# Altium project TemperatureController.PrjPcb (part 2 of 4)

## Sheet relays.SchDoc: TemperatureTransducer
size A3; Author: wq; DrawnBy: wq; Organization: Fulei Electronic; Address1: 14a Yulan Rd; Address2: Hefei; Address3: Anhui Pro.; Address4: CHN; DocumentNumber: 1; Revision: betaV1.0; SheetNumber: 1; SheetTotal: 1
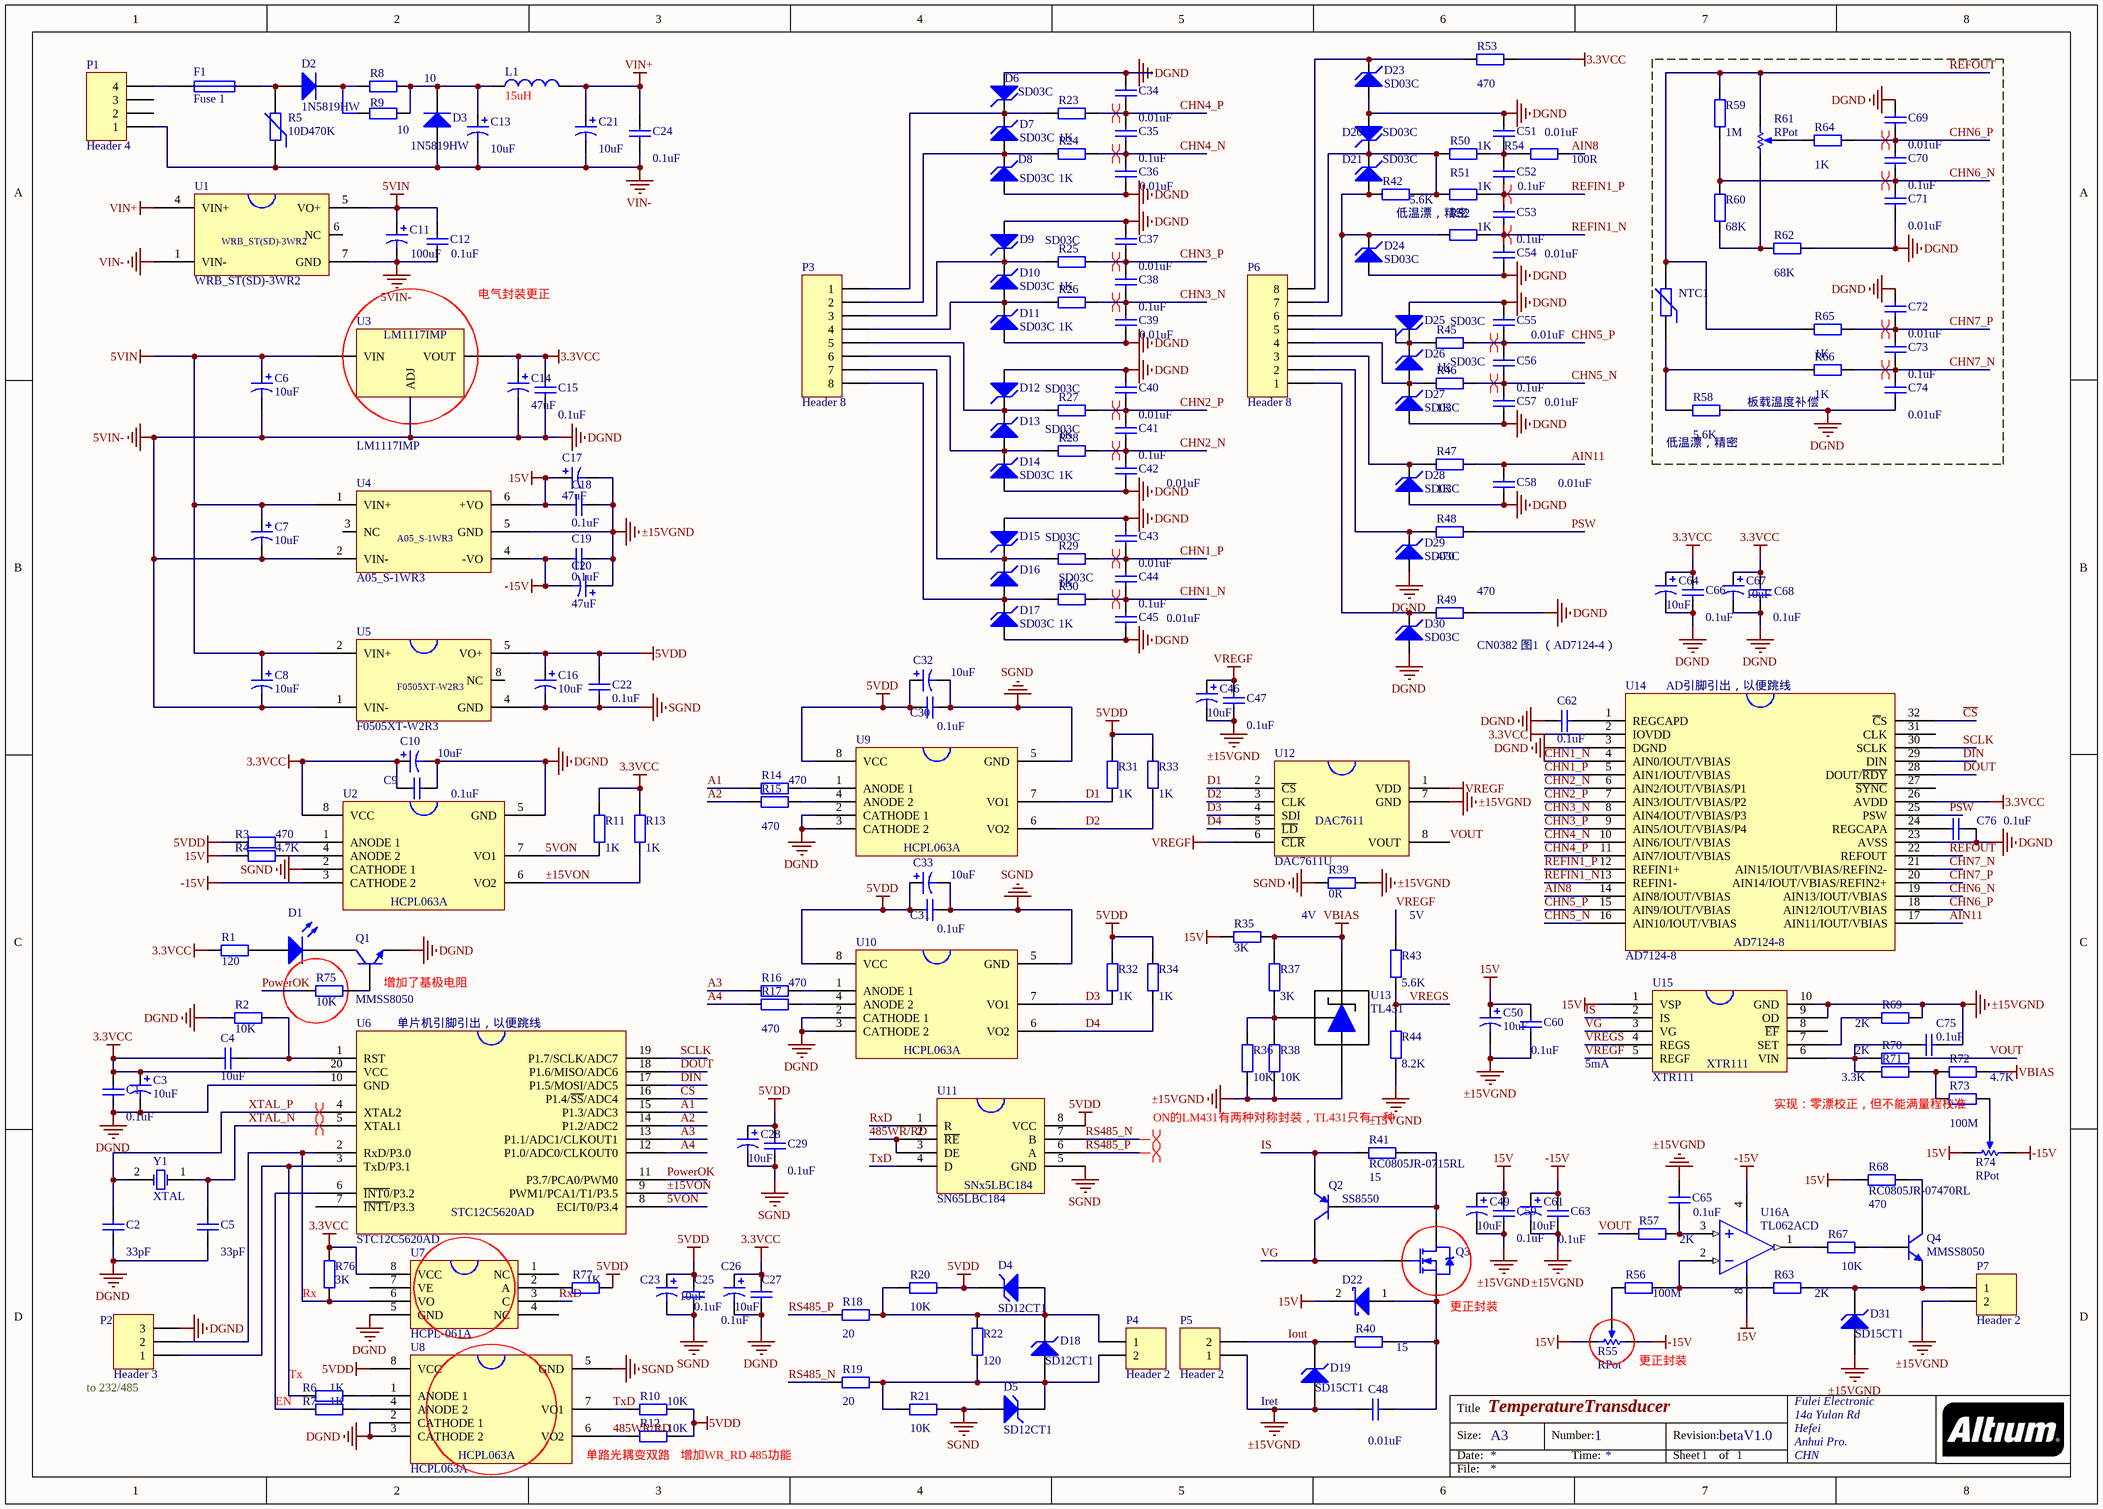
[diagram p2: relays.SchDoc]

### Parts
(Parts that share a designator on the sheet are numbered #1, #2 ... from top to bottom, then left to right.)
C1#2  value 0.1uF  [0805c]  (hidden comment: CC0805MRX7R9BB104)
C2#2  value 33pF  [0805c]  (hidden comment: CC0805MRX7R9BB330)
C3#2  value 10uF  [CB]  (hidden comment: T494B106M006AHAUTO)
C4#2  value 10uF  [0805c]  (hidden comment: CC0805MRX7R9BB106)
C5#2  value 33pF  [0805c]  (hidden comment: CC0805MRX7R9BB330)
C6#2  value 10uF  [CB]  (hidden comment: T494B106M006AHAUTO)
C7#2  value 10uF  [CB]  (hidden comment: T494B106M006AHAUTO)
C8#2  value 10uF  [CB]  (hidden comment: T494B106M006AHAUTO)
C9#2  value 0.1uF  [0805c]  (hidden comment: CC0805MRX7R9BB104)
C10#2  value 10uF  [CB]  (hidden comment: T494B106M006AHAUTO)
C11#2  value 100uF  [CB]  (hidden comment: T494B107M006AHAUTO)
C12#2  value 0.1uF  [0805c]  (hidden comment: CC0805MRX7R9BB104)
C13#2  value 10uF  [Φ6.3×11.5]  (hidden comment: ECR1HQG100M-063007)
C14#2  value 47uF  [CB]  (hidden comment: T494B476M010AHAUTO)
C15#2  value 0.1uF  [0805c]  (hidden comment: CC0805MRX7R9BB104)
C16#2  value 10uF  [CB]  (hidden comment: T494B106M006AHAUTO)
C17#2  value 47uF  [CB]  (hidden comment: T494B476K025ATAUTO)
C18#2  value 0.1uF  [0805c]  (hidden comment: CC0805MRX7R9BB104)
C19#2  value 0.1uF  [0805c]  (hidden comment: CC0805MRX7R9BB104)
C20#2  value 47uF  [CB]  (hidden comment: T494B476K025ATAUTO)
C21#2  value 10uF  [Φ6.3×11.5]  (hidden comment: ECR1HQG100M-063007)
C22#2  value 0.1uF  [0805c]  (hidden comment: CC0805MRX7R9BB104)
C23#2  value 10uF  [CB]  (hidden comment: T494B106M006AHAUTO)
C24#2  value 0.1uF  [0805c]  (hidden comment: CC0805MRX7R9BB104)
C25#2  value 0.1uF  [0805c]  (hidden comment: CC0805MRX7R9BB104)
C26#2  value 10uF  [CB]  (hidden comment: T494B106M006AHAUTO)
C27#2  value 0.1uF  [0805c]  (hidden comment: CC0805MRX7R9BB104)
C28#2  value 10uF  [CB]  (hidden comment: T494B106M006AHAUTO)
C29#2  value 0.1uF  [0805c]  (hidden comment: CC0805MRX7R9BB104)
C30#3  value 0.1uF  [0805c]  (hidden comment: CC0805MRX7R9BB104)
C31#2  value 0.1uF  [0805c]  (hidden comment: CC0805MRX7R9BB104)
C32#3  value 10uF  [CB]  (hidden comment: T494B106M006AHAUTO)
C33#2  value 10uF  [CB]  (hidden comment: T494B106M006AHAUTO)
C34#2  value 0.01uF  [0805c]  (hidden comment: CC0805MRX7R9BB103)
C35#2  value 0.1uF  [0805c]  (hidden comment: CC0805MRX7R9BB104)
C36#2  value 0.01uF  [0805c]  (hidden comment: CC0805MRX7R9BB103)
C37#2  value 0.01uF  [0805c]  (hidden comment: CC0805MRX7R9BB103)
C38#2  value 0.1uF  [0805c]  (hidden comment: CC0805MRX7R9BB104)
C39#2  value 0.01uF  [0805c]  (hidden comment: CC0805MRX7R9BB103)
C40#2  value 0.01uF  [0805c]  (hidden comment: CC0805MRX7R9BB103)
C41#2  value 0.1uF  [0805c]  (hidden comment: CC0805MRX7R9BB104)
C42#2  value 0.01uF  [0805c]  (hidden comment: CC0805MRX7R9BB103)
C43#2  value 0.01uF  [0805c]  (hidden comment: CC0805MRX7R9BB103)
C44#2  value 0.1uF  [0805c]  (hidden comment: CC0805MRX7R9BB104)
C45#2  value 0.01uF  [0805c]  (hidden comment: CC0805MRX7R9BB103)
C46#3  value 10uF  [CB]  (hidden comment: T494B106M006AHAUTO)
C47#3  value 0.1uF  [0805c]  (hidden comment: CC0805MRX7R9BB104)
C48#2  value 0.01uF  [0805c]  (hidden comment: CC0805MRX7R9BB103)
C49#2  value 10uF  [CB]  (hidden comment: T494B106M025AHAUTO)
C50#2  value 10uF  [CB]  (hidden comment: T494B106M025AHAUTO)
C51#2  value 0.01uF  [0805c]  (hidden comment: CC0805MRX7R9BB103)
C52#2  value 0.1uF  [0805c]  (hidden comment: CC0805MRX7R9BB104)
C53#2  value 0.1uF  [0805c]  (hidden comment: CC0805MRX7R9BB104)
C54#2  value 0.01uF  [0805c]  (hidden comment: CC0805MRX7R9BB103)
C55#2  value 0.01uF  [0805c]  (hidden comment: CC0805MRX7R9BB103)
C56#2  value 0.1uF  [0805c]  (hidden comment: CC0805MRX7R9BB104)
C57#2  value 0.01uF  [0805c]  (hidden comment: CC0805MRX7R9BB103)
C58#2  value 0.01uF  [0805c]  (hidden comment: CC0805MRX7R9BB103)
C59#2  value 0.1uF  [0805c]  (hidden comment: CC0805MRX7R9BB104)
C60#2  value 0.1uF  [0805c]  (hidden comment: CC0805MRX7R9BB104)
C61#2  value 10uF  [CB]  (hidden comment: T494B106M025AHAUTO)
C62#2  value 0.1uF  [0805c]  (hidden comment: CC0805MRX7R9BB104)
C63#2  value 0.1uF  [0805c]  (hidden comment: CC0805MRX7R9BB104)
C64#2  value 10uF  [CB]  (hidden comment: T494B106M006AHAUTO)
C65#2  value 0.1uF  [0805c]  (hidden comment: CC0805MRX7R9BB104)
C66#2  value 0.1uF  [0805c]  (hidden comment: CC0805MRX7R9BB104)
C67#2  value 10uF  [CB]  (hidden comment: T494B106M006AHAUTO)
C68#2  value 0.1uF  [0805c]  (hidden comment: CC0805MRX7R9BB104)
C69#2  value 0.01uF  [0805c]  (hidden comment: CC0805MRX7R9BB103)
C70#2  value 0.1uF  [0805c]  (hidden comment: CC0805MRX7R9BB104)
C71#2  value 0.01uF  [0805c]  (hidden comment: CC0805MRX7R9BB103)
C72#2  value 0.01uF  [0805c]  (hidden comment: CC0805MRX7R9BB103)
C73#2  value 0.1uF  [0805c]  (hidden comment: CC0805MRX7R9BB104)
C74#2  value 0.01uF  [0805c]  (hidden comment: CC0805MRX7R9BB103)
C75#2  value 0.1uF  [0805c]  (hidden comment: CC0805MRX7R9BB104)
C76#2  value 0.1uF  [0805c]  (hidden comment: CC0805MRX7R9BB104)
D1#2  150080GS75000  [LEDΦ3.0]  (value not drawn)
D2#2  1N5819HW  [sod123]
D3#2  1N5819HW  [sod123]
D4#2  SD12CT1  [sod323]
D5#2  SD12CT1  [sod323]
D6#2  SD03C  [sod323]
D7#2  SD03C  [sod323]
D8#2  SD03C  [sod323]
D9#2  SD03C  [sod323]
D10#2  SD03C  [sod323]
D11#2  SD03C  [sod323]
D12#2  SD03C  [sod323]
D13#2  SD03C  [sod323]
D14#2  SD03C  [sod323]
D15#2  SD03C  [sod323]
D16#2  SD03C  [sod323]
D17#2  SD03C  [sod323]
D18#2  SD12CT1  [sod323]
D19#2  SD15CT1  [sod323]
D20#2  SD03C  [sod323]
D21#2  SD03C  [sod323]
D22#2  RB160MM-50TF  [sod123]  (value not drawn)
D23#2  SD03C  [sod323]
D24#2  SD03C  [sod323]
D25#2  SD03C  [sod323]
D26#2  SD03C  [sod323]
D27#2  SD03C  [sod323]
D28#2  SD03C  [sod323]
D29#2  SD03C  [sod323]
D30#2  SD03C  [sod323]
D31#2  SD15CT1  [sod323]
F1#2  Fuse 1  [0805r]
L1#2  value 15uH  [vls4012]  (hidden comment: VLS4012HBX-150M)
NTC1#2  NTCS0805E3103JHT  [0805r]  (value not drawn)
P1#2  Header 4  [HDR1X4]
P2#2  Header 3  [HDR1X3]
P3#2  Header 8  [HDR1X8]
P4#2  Header 2  [HDR1X2]
P5#2  Header 2  [HDR1X2]
P6#2  Header 8  [HDR1X8]
P7#2  Header 2  [HDR1X2]
Q1#2  MMSS8050  [SOT-23-BJT]
Q2#2  SS8550  [SOT-23-BJT]
Q3#2  SI2309  [SOT-23-MOS]  (value not drawn)
Q4#2  MMSS8050  [SOT-23-BJT]
R1#2  value 120  [0805R]  (hidden comment: RC0805JR-07120RL)
R2#2  value 10K  [0805R]  (hidden comment: RC0805JR-0710KL)
R3#2  value 470  [0805R]  (hidden comment: RC0805JR-07470RL)
R4#2  value 4.7K  [0805R]  (hidden comment: RC0805JR-074700RL)
R5#2  10D470K  [mov]
R6#2  value 1K  [0805R]  (hidden comment: RC0805JR-071KL)
R7#2  value 1K  [0805R]  (hidden comment: RC0805JR-071KL)
R8#2  value 10  [0805R]  (hidden comment: PNP-200KJBJ26-10R)
R9#2  value 10  [0805R]  (hidden comment: PNP-200KJBJ26-10R)
R10#2  value 10K  [0805R]  (hidden comment: RC0805JR-0710KRL)
R11#2  value 1K  [0805R]  (hidden comment: RC0805JR-071KL)
R12#2  value 10K  [0805R]  (hidden comment: RC0805JR-0710KRL)
R13#2  value 1K  [0805R]  (hidden comment: RC0805JR-071KL)
R14#2  value 470  [0805R]  (hidden comment: RC0805JR-07470RL)
R15#2  value 470  [0805R]  (hidden comment: RC0805JR-07470RL)
R16#2  value 470  [0805R]  (hidden comment: RC0805JR-07470RL)
R17#2  value 470  [0805R]  (hidden comment: RC0805JR-07470RL)
R18#2  value 20  [0805R]  (hidden comment: RC0805JR-0720RL)
R19#2  value 20  [0805R]  (hidden comment: RC0805JR-0720RL)
R20#2  value 10K  [0805R]  (hidden comment: RC0805JR-0710KL)
R21#2  value 10K  [0805R]  (hidden comment: RC0805JR-0710KL)
R22#2  value 120  [0805R]  (hidden comment: RC0805JR-07120RL)
R23#2  value 1K  [0805R]  (hidden comment: RC0805JR-071KL)
R24#2  value 1K  [0805R]  (hidden comment: RC0805JR-071KL)
R25#2  value 1K  [0805R]  (hidden comment: RC0805JR-071KL)
R26#2  value 1K  [0805R]  (hidden comment: RC0805JR-071KL)
R27#2  value 1K  [0805R]  (hidden comment: RC0805JR-071KL)
R28#2  value 1K  [0805R]  (hidden comment: RC0805JR-071KL)
R29#2  value 1K  [0805R]  (hidden comment: RC0805JR-071KL)
R30#2  value 1K  [0805R]  (hidden comment: RC0805JR-071KL)
R31#2  value 1K  [0805R]  (hidden comment: RC0805JR-071KL)
R32#2  value 1K  [0805R]  (hidden comment: RC0805JR-071KL)
R33#2  value 1K  [0805R]  (hidden comment: RC0805JR-071KL)
R34#2  value 1K  [0805R]  (hidden comment: RC0805JR-071KL)
R35#2  value 3K  [0805R]  (hidden comment: RC0805JR-073KL)
R36#2  value 10K  [0805R]  (hidden comment: RC0805JR-0710KL)
R37#2  value 3K  [0805R]  (hidden comment: RC0805JR-073KL)
R38#2  value 10K  [0805R]  (hidden comment: RC0805JR-0710KL)
R39#2  value 0R  [0805R]  (hidden comment: RC0805JR-000KL)
R40#2  value 15  [0805R]  (hidden comment: RC0805JR-0715RL)
R41#2  RC0805JR-0715RL  value 15  [0805R]
R42#2  value 5.6K  [0805R]  (hidden comment: RC0805JR-075600RL)
R43#2  value 5.6K  [0805R]  (hidden comment: RC0805JR-075600RL)
R44#2  value 8.2K  [0805R]  (hidden comment: RC0805JR-078200RL)
R45#2  value 1K  [0805R]  (hidden comment: RC0805JR-071KL)
R46#2  value 1K  [0805R]  (hidden comment: RC0805JR-071KL)
R47#2  value 1K  [0805R]  (hidden comment: RC0805JR-071KL)
R48#2  value 470  [0805R]  (hidden comment: RC0805JR-07470RL)
R49#2  value 470  [0805R]  (hidden comment: RC0805JR-07470RL)
R50#2  value 1K  [0805R]  (hidden comment: RC0805JR-071KL)
R51#2  value 1K  [0805R]  (hidden comment: RC0805JR-071KL)
R52#2  value 1K  [0805R]  (hidden comment: RC0805JR-071KL)
R53#2  value 470  [0805R]  (hidden comment: RC0805JR-07470RL)
R54#2  value 100R  [0805R]  (hidden comment: RC0805JR-07100RL)
R55#2  RPot  [VR5]
R56#2  value 100M  [0805R]  (hidden comment: RC0805JR-07100ML)
R57#2  value 2K  [0805R]  (hidden comment: RC0805JR-072KL)
R58#2  value 5.6K  [0805R]  (hidden comment: RC0805JR-075600RL)
R59#2  value 1M  [0805R]  (hidden comment: RC0805JR-071000KL)
R60#2  value 68K  [0805R]  (hidden comment: RC0805JR-0768KL)
R61#2  RPot  [VR5]
R62#2  value 68K  [0805R]  (hidden comment: RC0805JR-0768KL)
R63#2  value 2K  [0805R]  (hidden comment: RC0805JR-072KL)
R64#2  value 1K  [0805R]  (hidden comment: RC0805JR-071KL)
R65#2  value 1K  [0805R]  (hidden comment: RC0805JR-071KL)
R66#2  value 1K  [0805R]  (hidden comment: RC0805JR-071KL)
R67#2  value 10K  [0805R]  (hidden comment: RC0805JR-0710KL)
R68#2  RC0805JR-07470RL  value 470  [0805R]
R69#2  value 2K  [0805R]  (hidden comment: RC0805JR-072KL)
R70#2  value 2K  [0805R]  (hidden comment: RC0805JR-072KL)
R71#2  value 3.3K  [0805R]  (hidden comment: RC0805JR-073300RL)
R72#2  value 4.7K  [0805R]  (hidden comment: RC0805JR-074700RL)
R73#2  value 100M  [0805R]  (hidden comment: RC0805JR-07100ML)
R74#2  RPot  [VR5]
R75#2  value 10K  [0805R]  (hidden comment: RC0805JR-0710KL)
R76#2  value 3K  [0805R]  (hidden comment: RC0805JR-073KL)
R77#2  value 1K  [0805R]  (hidden comment: RC0805JR-071KL)
U1#2  WRB_ST(SD)-3WR2  [WRB_ST(SD)-3WR2]
U2#2  HCPL063A  [SO-8-N]  (value not drawn)
U3#2  LM1117IMP  [SOT223_M]
U4#2  A05_S-1WR3  [A05_S-1WR3]
U5#2  F0505XT-W2R3  [F0505XT-W2R3]
U6#2  STC12C5620AD  [SOP20]
U7#2  HCPL-061A  [SO-8-N]
U8#2  HCPL063A  [SO-8-N]
U9#2  HCPL063A  [SO-8-N]  (value not drawn)
U10#2  HCPL063A  [SO-8-N]  (value not drawn)
U11#2  SN65LBC184  [so-8-n]
U12#3  DAC7611U  [so-8-n]
U13#2  TL431  [SOT-23-3]
U14#2  AD7124-8  [TI-RHB32-3150X3150TP_V]
U15#2  XTR111  [S-PDSO-G10]
U16#2  TL062ACD  [so-8-n]  (part A of 2)
Y1#2  XTAL  [11.0592MHz]

### Nets
3.3VCC: C1#2.1 C3#2.1 C4#2.1 C9#2.1 C10#2.1 C14#2.1 C15#2.1 C26#2.1 C27#2.1 C64#2.1 C66#2.1 C67#2.1 C68#2.1 R1#2.1 R11#2.1 R13#2.1 R53#2.1 R76#2.2 U2#2.8(VCC) U3#2.2(VOUT) U6#2.20(VCC) U7#2.8(VCC) U14#2.2(IOVDD) U14#2.26(AVDD)
5VDD: C16#2.1 C22#2.2 C23#2.1 C25#2.1 C28#2.1 C29#2.1 C30#3.1 C31#2.1 C32#3.1 C33#2.1 D4#2.2(K) R3#2.2 R10#2.1 R12#2.1 R20#2.1 R31#2.1 R32#2.1 R33#2.1 R34#2.1 R77#2.1 U5#2.5(VO+) U8#2.8(VCC) U9#2.8(VCC) U10#2.8(VCC) U11#2.8(VCC)
5VIN: C6#2.1 C7#2.1 C8#2.1 C11#2.1 C12#2.2 U1#2.5(VO+) U3#2.3(VIN) U4#2.1(VIN+) U5#2.2(VIN+)
5VIN-: C1#2.2 C2#2.2 C3#2.2 C5#2.2 C6#2.2 C7#2.2 C8#2.2 C9#2.2 C10#2.2 C11#2.2 C12#2.1 C14#2.2 C15#2.2 C26#2.2 C27#2.2 C34#2.2 C36#2.2 C37#2.2 C39#2.2 C40#2.2 C42#2.2 C43#2.2 C45#2.2 C51#2.2 C54#2.2 C55#2.2 C57#2.2 C58#2.2 C62#2.1 C64#2.2 C66#2.2 C67#2.2 C68#2.2 C69#2.2 C71#2.2 C72#2.2 C74#2.2 C76#2.1 D6#2.1(ANODE) D8#2.1(ANODE) D9#2.1(ANODE) D11#2.1(ANODE) D12#2.1(ANODE) D14#2.1(ANODE) D15#2.1(ANODE) D17#2.1(ANODE) D20#2.1(ANODE) D23#2.1(ANODE) D24#2.1(ANODE) D25#2.1(ANODE) D27#2.1(ANODE) D28#2.1(ANODE) D29#2.1(ANODE) D30#2.1(ANODE) P2#2.3 Q1#2.3(E) R2#2.1 R49#2.1 R58#2.1 R62#2.1 U1#2.7(GND) U2#2.5(GND) U3#2.1(ADJ) U4#2.2(VIN-) U5#2.1(VIN-) U6#2.10(GND) U7#2.5(GND) U8#2.2(CATHODE_1) U8#2.3(CATHODE_2) U9#2.2(CATHODE_1) U9#2.3(CATHODE_2) U10#2.2(CATHODE_1) U10#2.3(CATHODE_2) U14#2.3(DGND) U14#2.23(AVSS)  [also labelled DGND]
15V: C17#2.1 C18#2.1 C49#2.1 C50#2.1 C59#2.2 C60#2.2 D22#2.2(K) R4#2.2 R35#2.1 R55#2.1(BOT) R68#2.1 R74#2.1(BOT) U4#2.6(+VO) U15#2.1(VSP) U16#2.8(VCC+)
-15V: C19#2.1 C20#2.2 C61#2.1 C63#2.2 R55#2.3(TOP) R74#2.3(TOP) U2#2.3(CATHODE_2) U4#2.4(-VO) U16#2.4(VCC-)
SGND: C16#2.2 C22#2.1 C23#2.2 C25#2.2 C28#2.2 C29#2.2 C30#3.2 C31#2.2 C32#3.2 C33#2.2 D5#2.1(A) R21#2.1 R39#2.1 U2#2.2(CATHODE_1) U5#2.4(GND) U8#2.5(GND) U9#2.5(GND) U10#2.5(GND) U11#2.5(GND)
VBIAS: R35#2.2 R37#2.1 R72#2.1 U13#2.1(CATHODE)
VIN+: C21#2.1 C24#2.1 L1#2.2 U1#2.4(VIN+)
VIN-: C13#2.2 C21#2.2 C24#2.2 D3#2.1(A) P1#2.1 R5#2.1 U1#2.1(VIN-)
VREGF: C46#3.1 C47#3.2 R43#2.1 U12#3.1(VDD) U12#3.6(~{CLR}) U15#2.5(REGF)
±15VGND: C17#2.2 C18#2.2 C19#2.2 C20#2.1 C46#3.2 C47#3.1 C48#2.2 C49#2.2 C50#2.2 C59#2.1 C60#2.1 C61#2.2 C63#2.1 C65#2.2 C75#2.1 D19#2.1(A) D31#2.1(A) P5#2.1 P7#2.2 R36#2.2 R38#2.2 R39#2.2 R44#2.2 R69#2.1 U4#2.5(GND) U12#3.7(GND) U13#2.3(ANODE) U15#2.9(OD) U15#2.10(GND)
5VON: R11#2.2 U2#2.7(VO1) U6#2.8(ECI/T0/P3.4)
485WR/RD: R12#2.2 U8#2.6(VO2) U11#2.2(~{RE}) U11#2.3(DE)
A1: R14#2.2 U6#2.15(P1.3/ADC3)
A2: R15#2.2 U6#2.14(P1.2/ADC2)
A3: R16#2.2 U6#2.13(P1.1/ADC1/CLKOUT1)
A4: R17#2.2 U6#2.12(P1.0/ADC0/CLKOUT0)
AIN8: R54#2.1 U14#2.14(AIN8/IOUT/VBIAS)
AIN11: C58#2.1 R47#2.1 U14#2.17(AIN11/IOUT/VBIAS)
~{CS}: U6#2.16(P1.4/~{SS}/ADC4) U14#2.32(~{C}S)
CHN1_N: C44#2.2 C45#2.1 R30#2.1 U14#2.4(AIN0/IOUT/VBIAS)
CHN1_P: C43#2.1 C44#2.1 R29#2.1 U14#2.5(AIN1/IOUT/VBIAS)
CHN2_N: C41#2.2 C42#2.1 R28#2.1 U14#2.6(AIN2/IOUT/VBIAS/P1)
CHN2_P: C40#2.1 C41#2.1 R27#2.1 U14#2.7(AIN3/IOUT/VBIAS/P2)
CHN3_N: C38#2.2 C39#2.1 R26#2.1 U14#2.8(AIN4/IOUT/VBIAS/P3)
CHN3_P: C37#2.1 C38#2.1 R25#2.1 U14#2.9(AIN5/IOUT/VBIAS/P4)
CHN4_N: C35#2.2 C36#2.1 R24#2.1 U14#2.10(AIN6/IOUT/VBIAS)
CHN4_P: C34#2.1 C35#2.1 R23#2.1 U14#2.11(AIN7/IOUT/VBIAS)
CHN5_N: C56#2.2 C57#2.1 R46#2.1 U14#2.16(AIN10/IOUT/VBIAS)
CHN5_P: C55#2.1 C56#2.1 R45#2.1 U14#2.15(AIN9/IOUT/VBIAS)
CHN6_N: C70#2.2 C71#2.1 R59#2.2 R60#2.1 U14#2.19(AIN13/IOUT/VBIAS)
CHN6_P: C69#2.1 C70#2.1 R64#2.1 U14#2.18(AIN12/IOUT/VBIAS)
CHN7_N: C73#2.2 C74#2.1 R66#2.1 U14#2.21(AIN15/IOUT/VBIAS/REFIN2-)
CHN7_P: C72#2.1 C73#2.1 R65#2.1 U14#2.20(AIN14/IOUT/VBIAS/REFIN2+)
D1: R31#2.2 U9#2.7(VO1) U12#3.2(~{CS})
D2: R33#2.2 U9#2.6(VO2) U12#3.3(CLK)
D3: R32#2.2 U10#2.7(VO1) U12#3.4(SDI)
D4: R34#2.2 U10#2.6(VO2) U12#3.5(~{LD})
DIN: U6#2.17(P1.5/MOSI/ADC5) U14#2.29(DIN)
DOUT: U6#2.18(P1.6/MISO/ADC6) U14#2.28(DOUT/~{RDY})
Iout: D19#2.2(K) P5#2.2 R40#2.1
IS: Q2#2.3(E) R41#2.2 U15#2.2(IS)
PowerOK: R75#2.1 U6#2.11(P3.7/PCA0/PWM0)
PSW: R48#2.1 U14#2.25(PSW)
REFIN1_N: C53#2.2 C54#2.1 R52#2.1 U14#2.13(REFIN1-)
REFIN1_P: C52#2.1 C53#2.1 R51#2.1 U14#2.12(REFIN1+)
REFOUT: NTC1#2.2 R59#2.1 R61#2.1(BOT) R65#2.2 U14#2.22(REFOUT)
RS485_N: R19#2.2 U11#2.7(B)
RS485_P: R18#2.1 U11#2.6(A)
RxD: U7#2.3(C) U11#2.1(R)
SCLK: U6#2.19(P1.7/SCLK/ADC7) U14#2.30(SCLK)
TxD: R10#2.2 U8#2.7(VO1) U11#2.4(D)
VG: Q2#2.1(C) Q3#2.1(G) U15#2.3(VG)
VOUT: R57#2.2 R70#2.1 U12#3.8(VOUT)
VREGS: R43#2.2 R44#2.1 U15#2.4(REGS)
XTAL_N: C5#2.1 U6#2.5(XTAL1) Y1#2.1(OSC1)
XTAL_P: C2#2.1 U6#2.4(XTAL2) Y1#2.2(OSC2)
±15VON: R13#2.2 U2#2.6(VO2) U6#2.9(PWM1/PCA1/T1/P3.5)
NetC4#2_2: C4#2.2 R2#2.2 U6#2.1(RST)
NetC13#2_1: C13#2.1 D3#2.2(K) L1#2.1 R8#2.1 R9#2.1
NetC48#2_1: C48#2.1 D22#2.1(A) Q3#2.3(S) R40#2.2
NetC51#2_1: C51#2.1 C52#2.2 R50#2.1 R54#2.2
NetC62#2_2: C62#2.2 U14#2.1(REGCAPD)
NetC65#2_1: C65#2.1 R57#2.1 U16#2.3(IN1+)
NetC75#2_2: C75#2.2 R70#2.2 R71#2.2 U15#2.6(VIN)
NetC76#2_2: C76#2.2 U14#2.24(REGCAPA)
NetD1#2_1: D1#2.1(A) R1#2.2
NetD1#2_2: D1#2.2(K) Q1#2.1(C)
NetD2#2_1: D2#2.1(A) F1#2.2 R5#2.2
NetD2#2_2: D2#2.2(K) R8#2.2 R9#2.2
NetD4#2_1: D4#2.1(A) D18#2.2(K) P4#2.1 R18#2.2 R20#2.2 R22#2.2
NetD5#2_2: D5#2.2(K) D18#2.1(A) P4#2.2 R19#2.1 R21#2.2 R22#2.1
NetD6#2_2: D6#2.2(CATHODE) D7#2.2(CATHODE) P3#2.1 R23#2.2
NetD7#2_1: D7#2.1(ANODE) D8#2.2(CATHODE) P3#2.2 R24#2.2
NetD9#2_2: D9#2.2(CATHODE) D10#2.2(CATHODE) P3#2.3 R25#2.2
NetD10#2_1: D10#2.1(ANODE) D11#2.2(CATHODE) P3#2.4 R26#2.2
NetD12#2_2: D12#2.2(CATHODE) D13#2.2(CATHODE) P3#2.5 R27#2.2
NetD13#2_1: D13#2.1(ANODE) D14#2.2(CATHODE) P3#2.6 R28#2.2
NetD15#2_2: D15#2.2(CATHODE) D16#2.2(CATHODE) P3#2.7 R29#2.2
NetD16#2_1: D16#2.1(ANODE) D17#2.2(CATHODE) P3#2.8 R30#2.2
NetD20#2_2: D20#2.2(CATHODE) D21#2.2(CATHODE) P6#2.7 R42#2.2 R50#2.2 R51#2.2
NetD21#2_1: D21#2.1(ANODE) D24#2.2(CATHODE) P6#2.6 R42#2.1 R52#2.2
NetD23#2_2: D23#2.2(CATHODE) P6#2.8 R53#2.2
NetD25#2_2: D25#2.2(CATHODE) D26#2.2(CATHODE) P6#2.5 R45#2.2
NetD26#2_1: D26#2.1(ANODE) D27#2.2(CATHODE) P6#2.4 R46#2.2
NetD28#2_2: D28#2.2(CATHODE) P6#2.3 R47#2.2
NetD29#2_2: D29#2.2(CATHODE) P6#2.2 R48#2.2
NetD30#2_2: D30#2.2(CATHODE) P6#2.1 R49#2.2
NetD31#2_2: D31#2.2(K) P7#2.1 Q4#2.3(E) R63#2.1
NetF1#2_1: F1#2.1 P1#2.4
NetNTC1#2_1: NTC1#2.1 R58#2.2 R66#2.2
NetP2#2_1: P2#2.1 R6#2.2 U6#2.3(TxD/P3.1)
NetP2#2_2: P2#2.2 R76#2.1 U6#2.2(RxD/P3.0) U7#2.6(VO)
NetQ1#2_2: Q1#2.2(B) R75#2.2
NetQ2#2_2: Q2#2.2(B) Q3#2.2(D) R41#2.1
NetQ4#2_1: Q4#2.1(C) R68#2.2
NetQ4#2_2: Q4#2.2(B) R67#2.1
NetR3#2_1: R3#2.1 U2#2.1(ANODE_1)
NetR4#2_1: R4#2.1 U2#2.4(ANODE_2)
NetR6#2_1: R6#2.1 U8#2.1(ANODE_1)
NetR7#2_1: R7#2.1 U8#2.4(ANODE_2)
NetR7#2_2: R7#2.2 U6#2.6(~{INT0}/P3.2)
NetR14#2_1: R14#2.1 U9#2.1(ANODE_1)
NetR15#2_1: R15#2.1 U9#2.4(ANODE_2)
NetR16#2_1: R16#2.1 U10#2.1(ANODE_1)
NetR17#2_1: R17#2.1 U10#2.4(ANODE_2)
NetR36#2_1: R36#2.1 R37#2.2 R38#2.1 U13#2.2(REF)
NetR55#2_2: R55#2.2(TAP) R56#2.2
NetR56#2_1: R56#2.1 R63#2.2 U16#2.2(IN1-)
NetR60#2_2: R60#2.2 R61#2.3(TOP) R62#2.2
NetR61#2_2: R61#2.2(TAP) R64#2.2
NetR67#2_2: R67#2.2 U16#2.1(OUT1)
NetR69#2_2: R69#2.2 U15#2.7(SET)
NetR71#2_1: R71#2.1 R72#2.2 R73#2.1
NetR73#2_2: R73#2.2 R74#2.2(TAP)
NetR77#2_2: R77#2.2 U7#2.2(A)

Not connected (* = marked no-connect by the designer): P1#2 2 3; U1#2 6(NC); U4#2 3(NC); U5#2 8(NC); U6#2 7(~{INT1}/P3.3); U7#2 1(NC) 4(NC) 7(VE); U14#2 27(~{SYNC}) 31(CLK); U15#2 8(~{EF})

### Layout directives
differential pair; differential pair class *: CHN1_P
differential pair: CHN1_N, CHN2_N, CHN2_P, CHN3_N, CHN3_P, CHN4_N, CHN4_P, CHN5_N, CHN5_P, CHN6_N, CHN6_P, CHN7_N, CHN7_P, REFIN1_N, REFIN1_P, RS485_N, RS485_P, XTAL_N, XTAL_P

### Notes on the sheet
- 低温漂，精密
- 电气封装更正
- (near R58#2) 低温漂，精密
- 板载温度补偿
- (near R49#2) CN0382 图1 （AD7124-4）
- (near U14#2) AD引脚引出，以便跳线
- 4V
- (near R43#2) 5V
- (near Q1#2) 增加了基极电阻
- (near U6#2) 单片机引脚引出，以便跳线
- ON的LM431有两种对称封装，TL431只有一种
- 5mA
- 实现：零漂校正，但不能满量程校准
- (near R76#2) Rx
- (near Q3#2) 更正封装
- (near P2#2) to 232/485
- Tx
- (near R55#2) 更正封装
- EN
- 单路光耦变双路
- (near R12#2) 增加WR_RD 485功能
- (near D19#2) Iret
- Title
- Size:
- Date:
- A3
- Number:
- Time:
- Revision:
- Sheet
- of
- File:

### Library data of the parts
C1#2 C2#2 C4#2 C5#2 C9#2 C12#2 C15#2 C18#2 C19#2 C22#2 C24#2 C25#2 C27#2 C29#2 C30#3 C31#2 C34#2 C35#2 C36#2 C37#2 C38#2 C39#2 C40#2 C41#2 C42#2 C43#2 C44#2 C45#2 C47#3 C48#2 C51#2 C52#2 C53#2 C54#2 C55#2 C56#2 C57#2 C58#2 C59#2 C60#2 C62#2 C63#2 C65#2 C66#2 C68#2 C69#2 C70#2 C71#2 C72#2 C73#2 C74#2 C75#2 C76#2 = Cap: Capacitor
  C2#2 C5#2 C9#2 C12#2 C15#2 C18#2 C19#2 C22#2 C24#2 C25#2 C27#2 C29#2 C30#3 C31#2 C34#2 C35#2 C36#2 C37#2 C38#2 C39#2 C40#2 C41#2 C42#2 C43#2 C44#2 C45#2 C47#3 C48#2 C51#2 C52#2 C53#2 C54#2 C55#2 C56#2 C57#2 C58#2 C59#2 C60#2 C62#2 C63#2 C65#2 C66#2 C68#2 C69#2 C70#2 C71#2 C72#2 C73#2 C74#2 C75#2 C76#2: Published: 8-Jun-2000; LatestRevisionDate: 17-Jul-2002; LatestRevisionNote: Re-released for DXP Platform.; PackageReference: RAD-0.3; Publisher: Altium Limited; PackageDescription: Radial Cap, Thru-Hole; 2 Leads; 0.3 in Pin Spacing
C3#2 C6#2 C7#2 C8#2 C10#2 C11#2 C13#2 C14#2 C16#2 C17#2 C20#2 C21#2 C23#2 C26#2 C28#2 C32#3 C33#2 C46#3 C49#2 C50#2 C61#2 C64#2 C67#2 = Cap Pol1: Polarized Capacitor (Radial); Published: 8-Jun-2000; LatestRevisionDate: 17-Jul-2002; LatestRevisionNote: Re-released for DXP Platform.; PackageReference: RB7.6-15; Publisher: Altium Limited; PackageDescription: Polarized Capacitor (Radial); 2 Leads
D1#2 = LED2: as D1#1 on sheet betaV1.0; Published: 8-Jun-2000; LatestRevisionDate: 17-Jul-2002; LatestRevisionNote: Re-released for DXP Platform.; PackageVersion: Feb-2002; PackageReference: 3.2X1.6X1.1; Publisher: Altium Limited; PackageDescription: SM LED; 2 Flat Leads
D2#2 D3#2 = Diode: Default Diode; Published: 8-Jun-2000; LatestRevisionDate: 17-Jul-2002; LatestRevisionNote: Re-released for DXP Platform.; PackageVersion: Sep-1996; PackageReference: SMC; Publisher: Altium Limited; PackageDescription: DO-214-AB/SMC; 2 C-Bend Leads; Body 7.9 x 5.9 mm, inc. leads (LxW); Code_JEDEC: DO-214-AB
D4#2 D5#2 D18#2 D19#2 D31#2 = D Zener: Zener Diode; Published: 8-Jun-2000; LatestRevisionDate: 17-Jul-2002; LatestRevisionNote: Re-released for DXP Platform.; PackageReference: DIODE-0.7; Publisher: Altium Limited; PackageDescription: Diode, Thru-Hole; 2 Leads; 0.7 in Pin Spacing
D6#2 D7#2 D8#2 D9#2 D10#2 D11#2 D12#2 D13#2 D14#2 D15#2 D16#2 D17#2 D20#2 D21#2 D23#2 D24#2 D25#2 D26#2 D27#2 D28#2 D29#2 D30#2 = TVS DIODE
D22#2 = D Schottky: Schottky Diode; Published: 8-Jun-2000; LatestRevisionDate: 17-Jul-2002; LatestRevisionNote: Re-released for DXP Platform.; PackageReference: SMB; Publisher: Altium Limited; PackageDescription: DO-214-AA/SMB; 2 C-Bend Leads; Body 5.3 x 3.6 mm, inc. leads (LxW); Code_JEDEC: DO-214-AA
F1#2 = Fuse 1: Fuse; Published: 8-Jun-2000; LatestRevisionDate: 17-Jul-2002; LatestRevisionNote: Re-released for DXP Platform.; PackageReference: PIN-W2/E2.8; Publisher: Altium Limited; PackageDescription: Thru-Hole; 2 Leads
L1#2 = Inductor
NTC1#2 R5#2 = Res Varistor: Varistor (Voltage-Sensitive Resistor); Published: 24-Mar-1999; LatestRevisionDate: 29-May-2009; LatestRevisionNote: IPC-7351 Footprint Added.; PackageVersion: Mar-2003; PackageReference: 6-0805; Publisher: Altium Limited; PackageDescription: Chip Resistor 0805 Case Size; Code_IPC: RESC2012
P1#2 = Header 4: Header, 4-Pin; LatestRevisionDate: 17-Jul-2002; LatestRevisionNote: Re-released for DXP Platform.; Publisher: Altium Limited
P2#2 = Header 3: Header, 3-Pin; LatestRevisionDate: 17-Jul-2002; LatestRevisionNote: Re-released for DXP Platform.; Publisher: Altium Limited
P3#2 P6#2 = Header 8: Header, 8-Pin; LatestRevisionDate: 17-Jul-2002; LatestRevisionNote: Re-released for DXP Platform.; Publisher: Altium Limited
P4#2 P5#2 P7#2 = Header 2: Header, 2-Pin; LatestRevisionDate: 17-Jul-2002; LatestRevisionNote: Re-released for DXP Platform.; Publisher: Altium Limited
Q1#2 Q4#2 = NPN: NPN Bipolar Transistor; Published: 8-Jun-2000; LatestRevisionDate: 17-Jul-2002; LatestRevisionNote: Re-released for DXP Platform.; PackageReference: TO-226-AA; Publisher: Altium Limited; PackageDescription: TO, Flat Index; 3 In-Line, Axial Leads; Body Dia. 4.8mm; Leads 0.55 x 0.51 mm (max); Code_JEDEC: TO-226-AA
Q2#2 = PNP: PNP Bipolar Transistor; Published: 8-Jun-2000; LatestRevisionDate: 29-May-2009; LatestRevisionNote: IPC-7351 Footprint Added.; PackageVersion: Aug-1999; PackageReference: SOT-23B; Publisher: Altium Limited; PackageDescription: 3-Pin SOT-23 Package 0.95 mm Pitch, 2.4 mm Lead Span
Q3#2 = NMOS-2: N-Channel Power MOSFET; Note: Pin 2 is electrically connected to pin 4.; Published: 8-Jun-2000; LatestRevisionDate: 17-Jul-2002; LatestRevisionNote: Re-released for DXP Platform.; DatasheetVersion: PD-9.814; PackageVersion: Feb-1997; PackageReference: TO-220AB; Publisher: Altium Limited; PackageDescription: TO, Thru-Hole, Vertical, Heatsink Mounted; 3 In-Line Leads; Pitch 2.54 mm; ComponentLink1Description: Manufacturer Link; ComponentLink1URL: http://www.irf.com/
R1#2 R2#2 R3#2 R4#2 R6#2 R7#2 R8#2 R9#2 R10#2 R11#2 R12#2 R13#2 R14#2 R15#2 R16#2 R17#2 R18#2 R19#2 R20#2 R21#2 R22#2 R23#2 R24#2 R25#2 R26#2 R27#2 R28#2 R29#2 R30#2 R31#2 R32#2 R33#2 R34#2 R35#2 R36#2 R37#2 R38#2 R39#2 R40#2 R41#2 R42#2 R43#2 R44#2 R45#2 R46#2 R47#2 R48#2 R49#2 R50#2 R51#2 R52#2 R53#2 R54#2 R56#2 R57#2 R58#2 R59#2 R60#2 R62#2 R63#2 R64#2 R65#2 R66#2 R67#2 R68#2 R69#2 R70#2 R71#2 R72#2 R73#2 R75#2 R76#2 R77#2 = Res2: Resistor; Published: 8-Jun-2000; LatestRevisionDate: 17-Jul-2002; LatestRevisionNote: Re-released for DXP Platform.; PackageReference: AXIAL-0.4; Publisher: Altium Limited; PackageDescription: Axial Device, Thru-Hole; 2 Leads; 0.4 in Pin Spacing
R55#2 R61#2 R74#2 = RPot: Potentiometer; Sim Note: Enter the Resistance value and the set point into parameter fields.; Set Position: 0.5; Value: 1K; Published: 8-Jun-2000; LatestRevisionDate: 17-Jul-2002; LatestRevisionNote: Re-released for DXP Platform.; PackageReference: VR5; Publisher: Altium Limited; PackageDescription: Variable Resistor, Thru-Hole; 3 Leads
U7#2 = 6N137
U11#2 = SNx5LBC184
U12#3 = DAC7611
U16#2 = TL062ACD: Low-Power JFET-Input Operational Amplifier, 7 to 36 V, 0 to 70 degC, 8-pin SOIC (D8), Green (RoHS & no Sb/Br); Manufacturer: Texas Instruments; CMRR(Min)(dB): 80; GBW(Typ)(MHz): 1; IIB(Max)(pA): 200; Iq per channel(Max)(mA): 0.25; Number of Channels: 2; Offset Drift(Typ)(uV/C): 10; Rating: Catalog; Slew Rate(Typ)(V/us): 3.5; Sub Family: General Purpose Amplifier, High Supply Voltage Amplifier (>=30V), Low Power Amp (<=500uA); Total Supply Voltage(Max)(+5V is 5, +/-5V is 10): 36; Total Supply Voltage(Min)(+5V is 5, +/-5V is 10): 7; Vio (25C)(Max)(mV): 6; Vn at 1kHz(Typ)(nV/rtHz): 42; DatasheetVersion: SLOS078J; PackageVersion: 4040047-3/M, 06/2011; PackageReference: D8; PackageDescription: 8-Pin Plastic Small Outline, Body 4.9 x 3.9 mm, Pitch 1.27 mm; Supplier 1: Digi-Key; Supplier Part Number 1: 296-7175-5-ND; Supplier 2: Farnell; Supplier Part Number 2: 9593241; Supplier 3: Newark; Supplier Part Number 3: 08F9224; Supplier 4: Mouser; Supplier Part Number 4: 595-TL062ACD; Eco-Plan: Green (RoHS & no Sb/Br); Mounting Technology: Surface Mount; Code_JEDEC: MS-012; PartNumber: TL062ACD; ComponentLink1Description: Manufacturer URL; ComponentLink1URL: http://www.ti.com/; ComponentLink2Description: Datasheet; ComponentLink2URL: http://www.ti.com/lit/ds/symlink/tl062a.pdf; ComponentLink3Description: Package Specification; ComponentLink3URL: http://www.ti.com/litv/pdf/msoi002j
Y1#2 = XTAL: Crystal Oscillator; Published: 8-Jun-2000; LatestRevisionDate: 17-Jul-2002; LatestRevisionNote: Re-released for DXP Platform.; PackageReference: R38; Publisher: Altium Limited; PackageDescription: Crystal, Thru-Hole; 2 Leads; Body 3.1 x 8.2 mm (Dia.xH)

## Sheet rs485.SchDoc
size A4; Organization: 合肥弗雷电子; Address1: 玉兰大道14号D栋3楼; Address2: 肥西县桃花镇; Address3: 合肥市; Address4: 安徽省
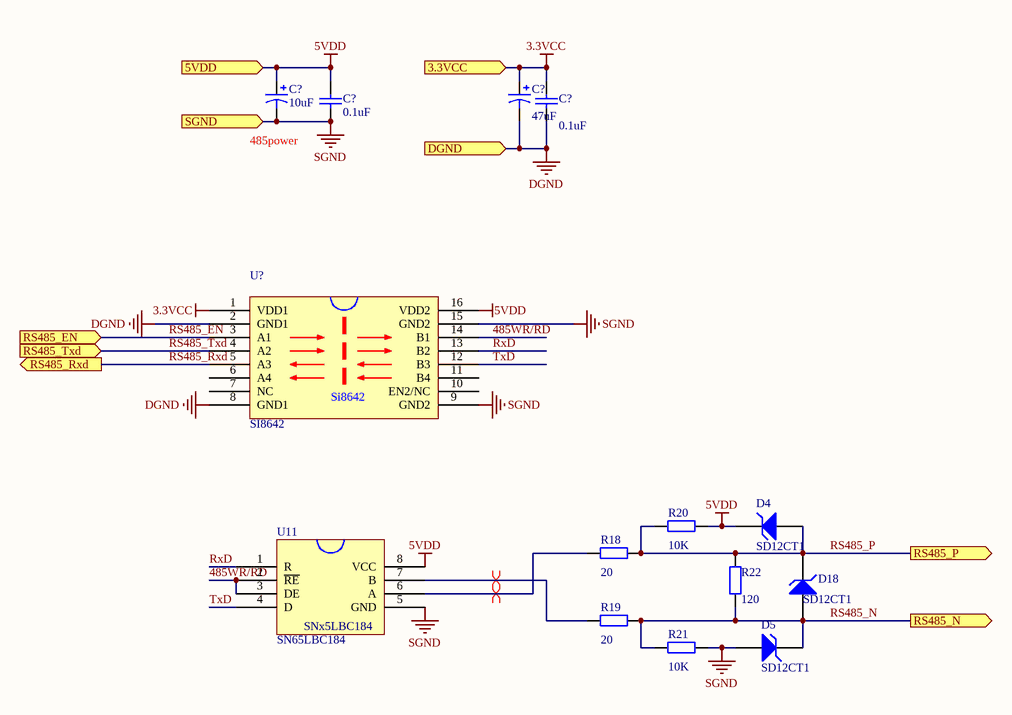
[diagram p3: rs485.SchDoc]

### Parts
(Parts that share a designator on the sheet are numbered #1, #2 ... from top to bottom, then left to right.)
C?#25  value 10uF  [CB]  (hidden comment: T494B106M006AHAUTO)
C?#26  value 47uF  [CB]  (hidden comment: T494B476M010AHAUTO)
C?#27  value 0.1uF  [0805c]  (hidden comment: CC0805MRX7R9BB104)
C?#28  value 0.1uF  [0805c]  (hidden comment: CC0805MRX7R9BB104)
D4#3  SD12CT1  [sod323]
D5#3  SD12CT1  [sod323]
D18#3  SD12CT1  [sod323]
R18#3  value 20  [0805R]  (hidden comment: RC0805JR-0720RL)
R19#3  value 20  [0805R]  (hidden comment: RC0805JR-0720RL)
R20#3  value 10K  [0805R]  (hidden comment: RC0805JR-0710KL)
R21#3  value 10K  [0805R]  (hidden comment: RC0805JR-0710KL)
R22#3  value 120  [0805R]  (hidden comment: RC0805JR-07120RL)
U11#3  SN65LBC184  [so-8-n]
U?#11  SI8642

### Ports
3.3VCC (in), 5VDD (in), DGND (in), RS485_EN (in), RS485_N (out), RS485_P (out), RS485_Rxd (out), RS485_Txd (in), SGND (in)

### Nets
3.3VCC: C?#26.1 C?#27.1 U?#11.1(VDD1) ; port 3.3VCC
5VDD: C?#25.1 C?#28.2 D4#3.2(K) R20#3.1 U11#3.8(VCC) U?#11.16(VDD2) ; port 5VDD
DGND: C?#26.2 C?#27.2 U?#11.2(GND1) U?#11.8(GND1) ; port DGND  [project net 5VIN-]
SGND: C?#25.2 C?#28.1 D5#3.1(A) R21#3.1 U11#3.5(GND) U?#11.9(GND2) U?#11.15(GND2) ; port SGND
485WR/RD: U11#3.2(~{RE}) U11#3.3(DE) U?#11.14(B1)
RS485_EN: U?#11.3(A1) ; port RS485_EN
RS485_N: D5#3.2(K) D18#3.1(A) R19#3.1 R21#3.2 R22#3.1 ; port RS485_N
RS485_P: D4#3.1(A) D18#3.2(K) R18#3.2 R20#3.2 R22#3.2 ; port RS485_P
RS485_Rxd: U?#11.5(A3) ; port RS485_Rxd
RS485_Txd: U?#11.4(A2) ; port RS485_Txd
RxD: U11#3.1(R) U?#11.13(B2)
TxD: U11#3.4(D) U?#11.12(B3)
NetR18#3_1: R18#3.1 U11#3.6(A)
NetR19#3_2: R19#3.2 U11#3.7(B)

Not connected (* = marked no-connect by the designer): U?#11 6(A4) 7(NC) 10(EN2/NC) 11(B4)

### Layout directives
differential pair: NetR18#3_1, NetR19#3_2

### Notes on the sheet
- (near C?#25) 485power
- Title
- Size:
- Date:
- A4
- Number:
- Time:
- Revision:
- Sheet
- of
- File:
- (in symbol SI8642) Si8642

### Library data of the parts
C?#25 C?#26 = Cap Pol1: Polarized Capacitor (Radial); Published: 8-Jun-2000; LatestRevisionDate: 17-Jul-2002; LatestRevisionNote: Re-released for DXP Platform.; PackageReference: RB7.6-15; Publisher: Altium Limited; PackageDescription: Polarized Capacitor (Radial); 2 Leads
C?#27 C?#28 = Cap: Capacitor; Published: 8-Jun-2000; LatestRevisionDate: 17-Jul-2002; LatestRevisionNote: Re-released for DXP Platform.; PackageReference: RAD-0.3; Publisher: Altium Limited; PackageDescription: Radial Cap, Thru-Hole; 2 Leads; 0.3 in Pin Spacing
D4#3 D5#3 D18#3 = D Zener: Zener Diode; Published: 8-Jun-2000; LatestRevisionDate: 17-Jul-2002; LatestRevisionNote: Re-released for DXP Platform.; PackageReference: DIODE-0.7; Publisher: Altium Limited; PackageDescription: Diode, Thru-Hole; 2 Leads; 0.7 in Pin Spacing
R18#3 R19#3 R20#3 R21#3 R22#3 = Res2: Resistor; Published: 8-Jun-2000; LatestRevisionDate: 17-Jul-2002; LatestRevisionNote: Re-released for DXP Platform.; PackageReference: AXIAL-0.4; Publisher: Altium Limited; PackageDescription: Axial Device, Thru-Hole; 2 Leads; 0.4 in Pin Spacing
U11#3 = SNx5LBC184

## Sheet hmi.SchDoc: HMI
size A4 portrait; Author: wq; DrawnBy: wq; Organization: Fulei Electronic; Address1: 14a Yulan Rd; Address2: Hefei; Address3: Anhui Pro.; Address4: CHN; DocumentNumber: 1; Revision: betaV1.0; SheetNumber: 1; SheetTotal: 1
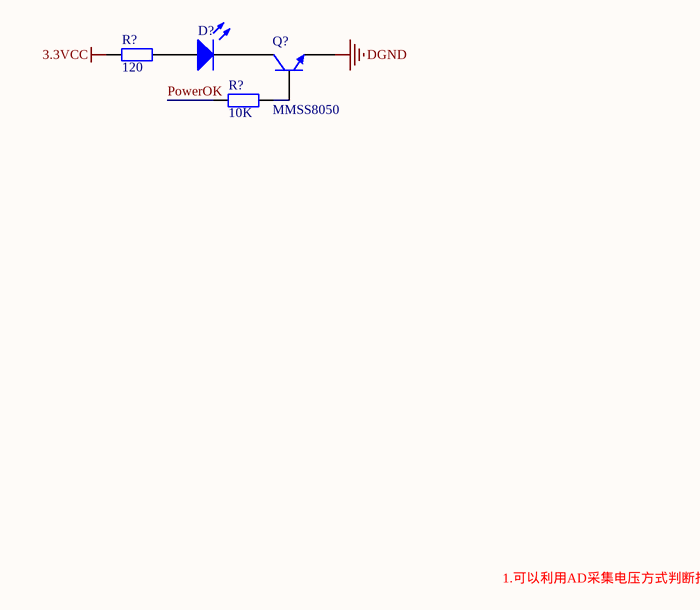
[diagram p4: hmi.SchDoc]

### Parts
(Parts that share a designator on the sheet are numbered #1, #2 ... from top to bottom, then left to right.)
D?#1  150080GS75000  [LEDΦ3.0]  (value not drawn)
Q?#1  MMSS8050  [SOT-23-BJT]
R?#1  value 120  [0805R]  (hidden comment: RC0805JR-07120RL)
R?#2  value 10K  [0805R]  (hidden comment: RC0805JR-0710KL)

### Nets
3.3VCC: R?#1.1
DGND: Q?#1.3(E)  [project net 5VIN-]
PowerOK: R?#2.1
NetD?#1_1: D?#1.1(A) R?#1.2
NetD?#1_2: D?#1.2(K) Q?#1.1(C)
NetQ?#1_2: Q?#1.2(B) R?#2.2

### Notes on the sheet
- 1.可以利用AD采集电压方式判断按钮；节约IO
- Title
- Size:
- Date:
- A4
- Number:
- Time:
- Revision:
- Sheet
- of
- File:

### Library data of the parts
D?#1 = LED2: Typical RED, GREEN, YELLOW, AMBER GaAs LED; Published: 8-Jun-2000; LatestRevisionDate: 17-Jul-2002; LatestRevisionNote: Re-released for DXP Platform.; PackageVersion: Feb-2002; PackageReference: 3.2X1.6X1.1; Publisher: Altium Limited; PackageDescription: SM LED; 2 Flat Leads
Q?#1 = NPN: NPN Bipolar Transistor; Published: 8-Jun-2000; LatestRevisionDate: 17-Jul-2002; LatestRevisionNote: Re-released for DXP Platform.; PackageReference: TO-226-AA; Publisher: Altium Limited; PackageDescription: TO, Flat Index; 3 In-Line, Axial Leads; Body Dia. 4.8mm; Leads 0.55 x 0.51 mm (max); Code_JEDEC: TO-226-AA
R?#1 R?#2 = Res2: Resistor; Published: 8-Jun-2000; LatestRevisionDate: 17-Jul-2002; LatestRevisionNote: Re-released for DXP Platform.; PackageReference: AXIAL-0.4; Publisher: Altium Limited; PackageDescription: Axial Device, Thru-Hole; 2 Leads; 0.4 in Pin Spacing

## Sheet iout.SchDoc: Iout
size A3; Organization: 合肥弗雷电子; Address1: 玉兰达到14号D栋3楼; Address2: 肥西县桃花镇; Address3: 合肥市; Address4: 安徽省; DocumentNumber: 1; Revision: betaV1.0; SheetNumber: 1; SheetTotal: 1

### Notes on the sheet
- Title
- Size:
- Date:
- A3
- Number:
- Time:
- Revision:
- Sheet
- of
- File:

## Sheet viout.SchDoc: VIout
size A3; Organization: 合肥弗雷电子; Address1: 玉兰达到14号D栋3楼; Address2: 肥西县桃花镇; Address3: 合肥市; Address4: 安徽省; Revision: betaV1.0; SheetNumber: 1; SheetTotal: 1
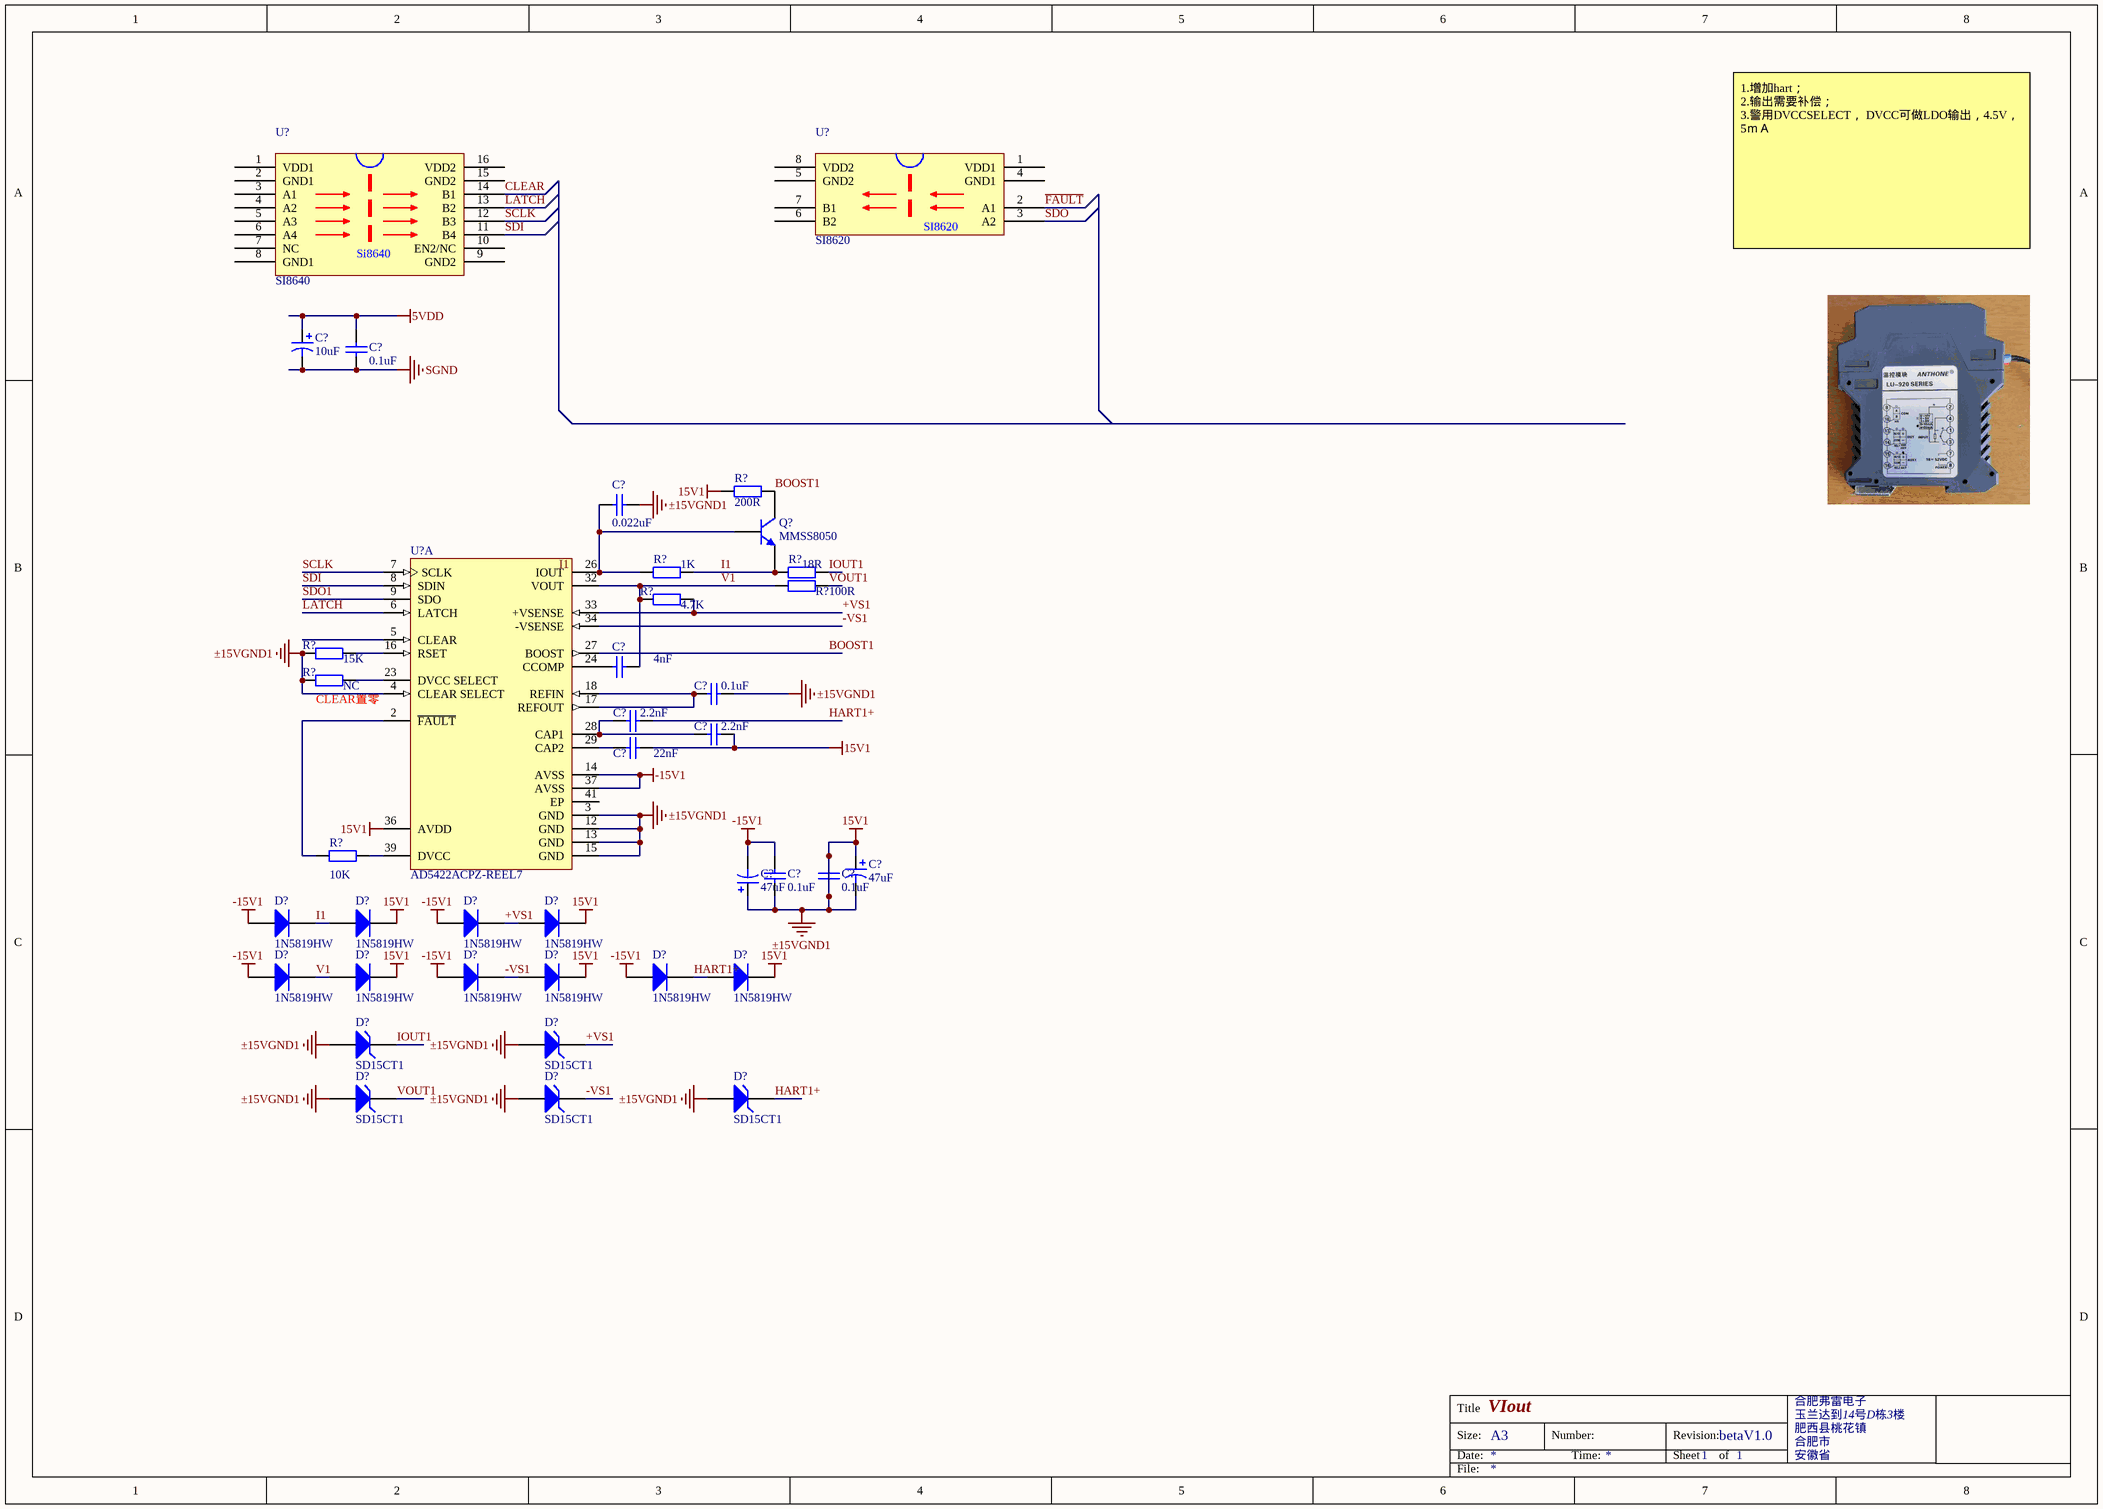
[diagram p5: viout.SchDoc]

### Parts
(Parts that share a designator on the sheet are numbered #1, #2 ... from top to bottom, then left to right.)
C?#29  value 10uF  [CB]  (hidden comment: T494B106M006AHAUTO)
C?#30  value 0.1uF  [0805c]  (hidden comment: CC0805MRX7R9BB104)
C?#31  value 0.022uF  [0805c]  (hidden comment: CC0805MRX7R9BB103)
C?#32  value 4nF  [0805c]
C?#33  value 0.1uF  [0805c]  (hidden comment: CC0805MRX7R9BB104)
C?#34  value 2.2nF  [0805c]
C?#35  value 2.2nF  [0805c]
C?#36  value 22nF  [0805c]
C?#37  value 0.1uF  [0805c]  (hidden comment: CC0805MRX7R9BB104)
C?#38  value 0.1uF  [0805c]  (hidden comment: CC0805MRX7R9BB104)
C?#39  value 47uF  [CB]  (hidden comment: T494B476K025ATAUTO)
C?#40  value 47uF  [CB]  (hidden comment: T494B476K025ATAUTO)
D?#2  1N5819HW  [sod123]
D?#3  1N5819HW  [sod123]
D?#4  1N5819HW  [sod123]
D?#5  1N5819HW  [sod123]
D?#6  1N5819HW  [sod123]
D?#7  1N5819HW  [sod123]
D?#8  1N5819HW  [sod123]
D?#9  1N5819HW  [sod123]
D?#10  1N5819HW  [sod123]
D?#11  1N5819HW  [sod123]
D?#12  SD15CT1  [sod323]
D?#13  SD15CT1  [sod323]
D?#14  SD15CT1  [sod323]
D?#15  SD15CT1  [sod323]
D?#16  SD15CT1  [sod323]
Q?#2  MMSS8050  [SOT-23-BJT]
R?#3  value 200R  [0805R]
R?#4  value 1K  [0805R]  (hidden comment: RC0805JR-071KL)
R?#5  value 18R  [0805R]
R?#6  value 100R  [0805R]
R?#7  value 4.7K  [0805R]
R?#8  value 15K  [0805R]  (hidden comment: E192)
R?#9  value NC  [0805R]  (hidden comment: E192)
R?#10  value 10K  [0805R]  (hidden comment: RC0805JR-0710KL)
U?#12  SI8640
U?#13  SI8620
U?#14  AD5422ACPZ-REEL7  [CP-40-1_N]  (part A of 2)

### Nets
5VDD: C?#29.1 C?#30.2
15V1: C?#31.1 C?#33.2 C?#35.1 C?#36.1 C?#37.2 C?#38.1 C?#38.2 C?#39.1 C?#39.2 C?#40.1 D?#3.2(K) D?#5.2(K) D?#7.2(K) D?#9.2(K) D?#11.2(K) D?#12.1(A) D?#13.1(A) D?#14.1(A) D?#15.1(A) D?#16.1(A) R?#3.2 R?#8.1 R?#9.1 U?#14.3(GND) U?#14.4(CLEAR_SELECT) U?#14.12(GND) U?#14.13(GND) U?#14.15(GND) U?#14.36(AVDD)  [also labelled ±15VGND1]
-15V1: C?#37.1 C?#40.2 D?#2.1(A) D?#4.1(A) D?#6.1(A) D?#8.1(A) D?#10.1(A) U?#14.14(AVSS) U?#14.37(AVSS)
SGND: C?#29.2 C?#30.1
+VS1: D?#4.2(K) D?#5.1(A) D?#13.2(K) R?#7.2 U?#14.33(+VSENSE)
-VS1: D?#8.2(K) D?#9.1(A) D?#15.2(K) U?#14.34(-VSENSE)
BOOST1: Q?#2.1(C) R?#3.1 U?#14.27(BOOST)
CLEAR: U?#12.14(B1)
~{FAULT}: U?#13.2(A1)
HART1+: C?#34.1 D?#10.2(K) D?#11.1(A) D?#16.2(K)
I1: D?#2.2(K) D?#3.1(A) Q?#2.3(E) R?#4.2 R?#5.1
IOUT1: D?#12.2(K) R?#5.2
LATCH: U?#12.13(B2) U?#14.6(LATCH)
SCLK: U?#12.12(B3) U?#14.7(SCLK)
SDI: U?#12.11(B4) U?#14.8(SDIN)
SDO: U?#13.3(A2)
SDO1: U?#14.9(SDO)
V1: C?#32.2 D?#6.2(K) D?#7.1(A) R?#6.1 R?#7.1 U?#14.32(VOUT)
VOUT1: D?#14.2(K) R?#6.2
NetC?#31_2: C?#31.2 Q?#2.2(B) R?#4.1 U?#14.26(IOUT)
NetC?#32_1: C?#32.1 U?#14.24(CCOMP)
NetC?#33_1: C?#33.1 U?#14.17(REFOUT) U?#14.18(REFIN)
NetC?#34_2: C?#34.2 C?#35.2 U?#14.28(CAP1)
NetC?#36_2: C?#36.2 U?#14.29(CAP2)
NetR?#8_2: R?#8.2 U?#14.16(RSET)
NetR?#9_2: R?#9.2 U?#14.23(DVCC_SELECT)
NetR?#10_1: R?#10.1 U?#14.39(DVCC)
NetR?#10_2: R?#10.2 U?#14.2(~{FAULT})

Not connected (* = marked no-connect by the designer): U?#12 1(VDD1) 2(GND1) 3(A1) 4(A2) 5(A3) 6(A4) 7(NC) 8(GND1) 9(GND2) 10(EN2/NC) 15(GND2) 16(VDD2); U?#13 1(VDD1) 4(GND1) 5(GND2) 6(B2) 7(B1) 8(VDD2); U?#14 5(CLEAR) 41(EP)

### Notes on the sheet
- 1.增加hart；
  2.输出需要补偿；
  3.警用DVCCSELECT， DVCC可做LDO输出，4.5V，5ｍＡ
- (near R?#9) CLEAR置零
- Labels drawn without touching a wire or pin: I1
- Title
- Size:
- Date:
- A3
- Number:
- Time:
- Revision:
- Sheet
- of
- File:
- (in symbol SI8640) Si8640

### Library data of the parts
C?#29 C?#39 C?#40 = Cap Pol1: Polarized Capacitor (Radial); Published: 8-Jun-2000; LatestRevisionDate: 17-Jul-2002; LatestRevisionNote: Re-released for DXP Platform.; PackageReference: RB7.6-15; Publisher: Altium Limited; PackageDescription: Polarized Capacitor (Radial); 2 Leads
C?#30-C?#38 = Cap: Capacitor; Published: 8-Jun-2000; LatestRevisionDate: 17-Jul-2002; LatestRevisionNote: Re-released for DXP Platform.; PackageReference: RAD-0.3; Publisher: Altium Limited; PackageDescription: Radial Cap, Thru-Hole; 2 Leads; 0.3 in Pin Spacing
D?#2-D?#11 = Diode: Default Diode; Published: 8-Jun-2000; LatestRevisionDate: 17-Jul-2002; LatestRevisionNote: Re-released for DXP Platform.; PackageVersion: Sep-1996; PackageReference: SMC; Publisher: Altium Limited; PackageDescription: DO-214-AB/SMC; 2 C-Bend Leads; Body 7.9 x 5.9 mm, inc. leads (LxW); Code_JEDEC: DO-214-AB
D?#12-D?#16 = D Zener: Zener Diode; Published: 8-Jun-2000; LatestRevisionDate: 17-Jul-2002; LatestRevisionNote: Re-released for DXP Platform.; PackageReference: DIODE-0.7; Publisher: Altium Limited; PackageDescription: Diode, Thru-Hole; 2 Leads; 0.7 in Pin Spacing
Q?#2 = NPN: NPN Bipolar Transistor; Published: 8-Jun-2000; LatestRevisionDate: 17-Jul-2002; LatestRevisionNote: Re-released for DXP Platform.; PackageReference: TO-226-AA; Publisher: Altium Limited; PackageDescription: TO, Flat Index; 3 In-Line, Axial Leads; Body Dia. 4.8mm; Leads 0.55 x 0.51 mm (max); Code_JEDEC: TO-226-AA
R?#3-R?#10 = Res2: Resistor; Published: 8-Jun-2000; LatestRevisionDate: 17-Jul-2002; LatestRevisionNote: Re-released for DXP Platform.; PackageReference: AXIAL-0.4; Publisher: Altium Limited; PackageDescription: Axial Device, Thru-Hole; 2 Leads; 0.4 in Pin Spacing
U?#14 = AD5422ACPZ-REEL7: Single 16-Bit Current Source Digital-to-Analog Converter with Serial Interface and HART Connectivity, -40 to +85 degC, CP-40-1, Pb-Free, Reel; Generic Part Number: AD5422; Manufacturer: Analog Devices; # DAC Outputs: 1; Max V+: 40V; Op Pwr Diss: 158mW; Resolution (Bits): 16; Settling Time: 18祍; Single Supply: No; DatasheetVersion: Rev.E; PackageVersion: Oct-2006; PackageReference: CP-40-1; PackageDescription: 40-Pin Lead Frame Chip Scale Package [LFCSP_VQ] Very Thin Quad; Supplier 1: Digi-Key; Supplier Part Number 1: AD5422ACPZ-REEL7TR-ND; Supplier 2: Digi-Key; Supplier Part Number 2: AD5422ACPZ-REEL7CT-ND; Supplier 3: Digi-Key; Supplier Part Number 3: AD5422ACPZ-REEL7DKR-ND; Supplier 4: Mouser; Supplier Part Number 4: 584-AD5422ACPZ-R7; Packing: Reel; RoHS: Y; Mounting Technology: Surface Mount; Code_JEDEC: MO-220-VJJD-2; PartNumber: AD5422ACPZ-REEL7; ComponentLink1Description: Manufacturer URL; ComponentLink1URL: http://www.analog.com/en/index.html; ComponentLink2Description: Datasheet; ComponentLink2URL: http://www.analog.com/static/imported-files/data_sheets/AD5412_5422.pdf; ComponentLink3Description: Package Specification; ComponentLink3URL: http://www.analog.com/static/imported-files/packages/PKG_PDF/LFCSP(CP)/CP_40_1.pdf; ComponentLink4Description: Product URL; ComponentLink4URL: http://www.analog.com/en/digital-to-analog-converters/da-converters/ad5422/products/product.html; ComponentLink5Description: Reference Design URL; ComponentLink5URL: http://www.analog.com/en/digital-to-analog-converters/da-converters/ad5422/products/product.html#prod_cross_sell

## Sheet infopage.SchDoc: TemperatureTransducer
size A3; Author: wq; DrawnBy: wq; Organization: 合肥弗雷电子; Address1: 玉兰大道14号D栋3楼; Address2: 肥西县桃花镇; Address3: 合肥市; Address4: 安徽省; DocumentNumber: 1; Revision: betaV1.0; SheetNumber: 1; SheetTotal: 1
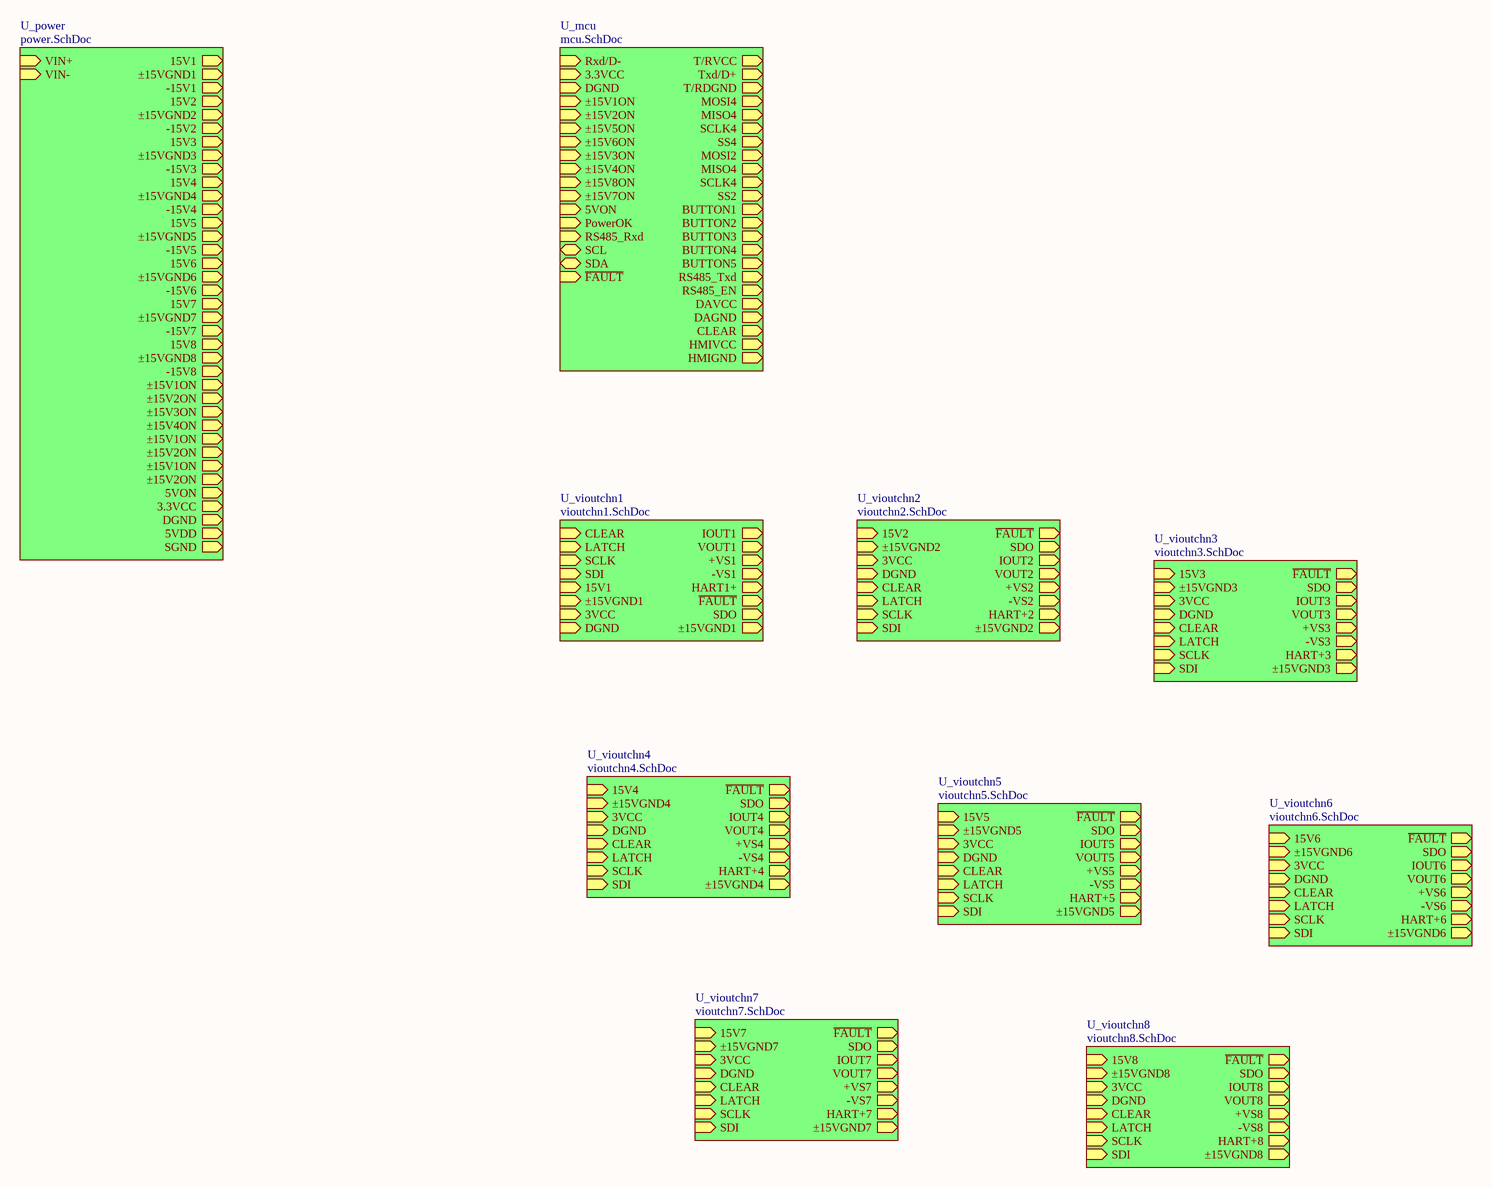
[diagram p6: infopage.SchDoc]

### Sub-sheets
U_mcu = mcu.SchDoc: T/RVCC (out), Txd/D+ (out), Rxd/D- (in), T/RDGND (out), 3.3VCC (in), DGND (in), MOSI4 (out), MISO4 (out), SCLK4 (out), SS4 (out), ±15V1ON (in), ±15V2ON (in), ±15V5ON (in), ±15V6ON (in), ±15V3ON (in), ±15V4ON (in), ±15V8ON (in), ±15V7ON (in), 5VON (in), PowerOK (in), MOSI2 (out), MISO4 (out), SCLK4 (out), SS2 (out), BUTTON1 (out), BUTTON2 (out), BUTTON3 (out), BUTTON4 (out), BUTTON5 (out), RS485_Txd (out), RS485_Rxd (in), RS485_EN (out), SCL (bidir), SDA (bidir), DAVCC (out), DAGND (out), CLEAR (out), ~{FAULT} (in), HMIVCC (out), HMIGND (out)
U_power = power.SchDoc: 15V1 (out), ±15VGND1 (out), -15V1 (out), 15V2 (out), ±15VGND2 (out), -15V2 (out), 15V3 (out), ±15VGND3 (out), -15V3 (out), 15V4 (out), ±15VGND4 (out), -15V4 (out), 15V5 (out), ±15VGND5 (out), -15V5 (out), 15V6 (out), ±15VGND6 (out), -15V6 (out), 15V7 (out), ±15VGND7 (out), -15V7 (out), 15V8 (out), ±15VGND8 (out), -15V8 (out), ±15V1ON (out), ±15V2ON (out), ±15V3ON (out), ±15V4ON (out), ±15V1ON (out), ±15V2ON (out), ±15V1ON (out), ±15V2ON (out), 5VON (out), VIN+ (in), VIN- (in), 3.3VCC (out), DGND (out), 5VDD (out), SGND (out)
U_vioutchn1 = vioutchn1.SchDoc: IOUT1 (out), VOUT1 (out), +VS1 (out), -VS1 (out), HART1+ (out), CLEAR (in), LATCH (in), SCLK (in), SDI (in), 15V1 (in), ±15VGND1 (in), 3VCC (in), DGND (in), ~{FAULT} (out), SDO (out), ±15VGND1 (out)
U_vioutchn2 = vioutchn2.SchDoc: 15V2 (in), ±15VGND2 (in), 3VCC (in), DGND (in), CLEAR (in), LATCH (in), SCLK (in), SDI (in), ~{FAULT} (out), SDO (out), IOUT2 (out), VOUT2 (out), +VS2 (out), -VS2 (out), HART+2 (out), ±15VGND2 (out)
U_vioutchn3 = vioutchn3.SchDoc: 15V3 (in), ±15VGND3 (in), 3VCC (in), DGND (in), CLEAR (in), LATCH (in), SCLK (in), SDI (in), ~{FAULT} (out), SDO (out), IOUT3 (out), VOUT3 (out), +VS3 (out), -VS3 (out), HART+3 (out), ±15VGND3 (out)
U_vioutchn4 = vioutchn4.SchDoc: 15V4 (in), ±15VGND4 (in), 3VCC (in), DGND (in), CLEAR (in), LATCH (in), SCLK (in), SDI (in), ~{FAULT} (out), SDO (out), IOUT4 (out), VOUT4 (out), +VS4 (out), -VS4 (out), HART+4 (out), ±15VGND4 (out)
U_vioutchn5 = vioutchn5.SchDoc: 15V5 (in), ±15VGND5 (in), 3VCC (in), DGND (in), CLEAR (in), LATCH (in), SCLK (in), SDI (in), ~{FAULT} (out), SDO (out), IOUT5 (out), VOUT5 (out), +VS5 (out), -VS5 (out), HART+5 (out), ±15VGND5 (out)
U_vioutchn6 = vioutchn6.SchDoc: 15V6 (in), ±15VGND6 (in), 3VCC (in), DGND (in), CLEAR (in), LATCH (in), SCLK (in), SDI (in), ~{FAULT} (out), SDO (out), IOUT6 (out), VOUT6 (out), +VS6 (out), -VS6 (out), HART+6 (out), ±15VGND6 (out)
U_vioutchn7 = vioutchn7.SchDoc: 15V7 (in), ±15VGND7 (in), 3VCC (in), DGND (in), CLEAR (in), LATCH (in), SCLK (in), SDI (in), ~{FAULT} (out), SDO (out), IOUT7 (out), VOUT7 (out), +VS7 (out), -VS7 (out), HART+7 (out), ±15VGND7 (out)
U_vioutchn8 = vioutchn8.SchDoc: 15V8 (in), ±15VGND8 (in), 3VCC (in), DGND (in), CLEAR (in), LATCH (in), SCLK (in), SDI (in), ~{FAULT} (out), SDO (out), IOUT8 (out), VOUT8 (out), +VS8 (out), -VS8 (out), HART+8 (out), ±15VGND8 (out)

### Nets
3.3VCC: sheet U_power/3.3VCC, sheet U_mcu/T/RVCC, sheet U_mcu/3.3VCC, sheet U_mcu/DAVCC, sheet U_mcu/HMIVCC
5VIN-: sheet U_power/DGND, sheet U_mcu/T/RDGND, sheet U_mcu/DGND, sheet U_mcu/DAGND, sheet U_mcu/HMIGND
15V1: sheet U_vioutchn1/15V1, sheet U_vioutchn1/±15VGND1, sheet U_vioutchn1/±15VGND1, sheet U_power/15V1, sheet U_power/±15VGND1, sheet U_power/±15VGND2, sheet U_power/±15VGND3, sheet U_power/±15VGND4, sheet U_power/±15VGND5, sheet U_power/±15VGND6, sheet U_power/±15VGND7, sheet U_power/±15VGND8
15V2: sheet U_vioutchn2/15V2, sheet U_vioutchn2/±15VGND2, sheet U_vioutchn2/±15VGND2, sheet U_power/15V2
15V3: sheet U_vioutchn3/15V3, sheet U_vioutchn3/±15VGND3, sheet U_vioutchn3/±15VGND3, sheet U_power/15V3
15V4: sheet U_vioutchn4/15V4, sheet U_vioutchn4/±15VGND4, sheet U_vioutchn4/±15VGND4, sheet U_power/15V4
15V5: sheet U_vioutchn5/15V5, sheet U_vioutchn5/±15VGND5, sheet U_vioutchn5/±15VGND5, sheet U_power/15V5
15V6: sheet U_vioutchn6/15V6, sheet U_vioutchn6/±15VGND6, sheet U_vioutchn6/±15VGND6, sheet U_power/15V6
15V7: sheet U_vioutchn7/15V7, sheet U_vioutchn7/±15VGND7, sheet U_vioutchn7/±15VGND7, sheet U_power/15V7
15V8: sheet U_vioutchn8/15V8, sheet U_vioutchn8/±15VGND8, sheet U_vioutchn8/±15VGND8, sheet U_power/15V8
MISO2: sheet U_mcu/MISO4, sheet U_mcu/MOSI2, sheet U_mcu/MISO4
SCLK2: sheet U_mcu/SCLK4, sheet U_mcu/SCLK4
±15V1ON: sheet U_power/±15V1ON, sheet U_power/±15V1ON, sheet U_power/±15V1ON
±15V2ON: sheet U_power/±15V2ON, sheet U_power/±15V2ON, sheet U_power/±15V2ON

### Notes on the sheet
- Title
- Size:
- Date:
- A3
- Number:
- Time:
- Revision:
- Sheet
- of
- File: